# EAGLE board HackerboatControlBoard (EAGLE 6.6.0), part 1 of 2
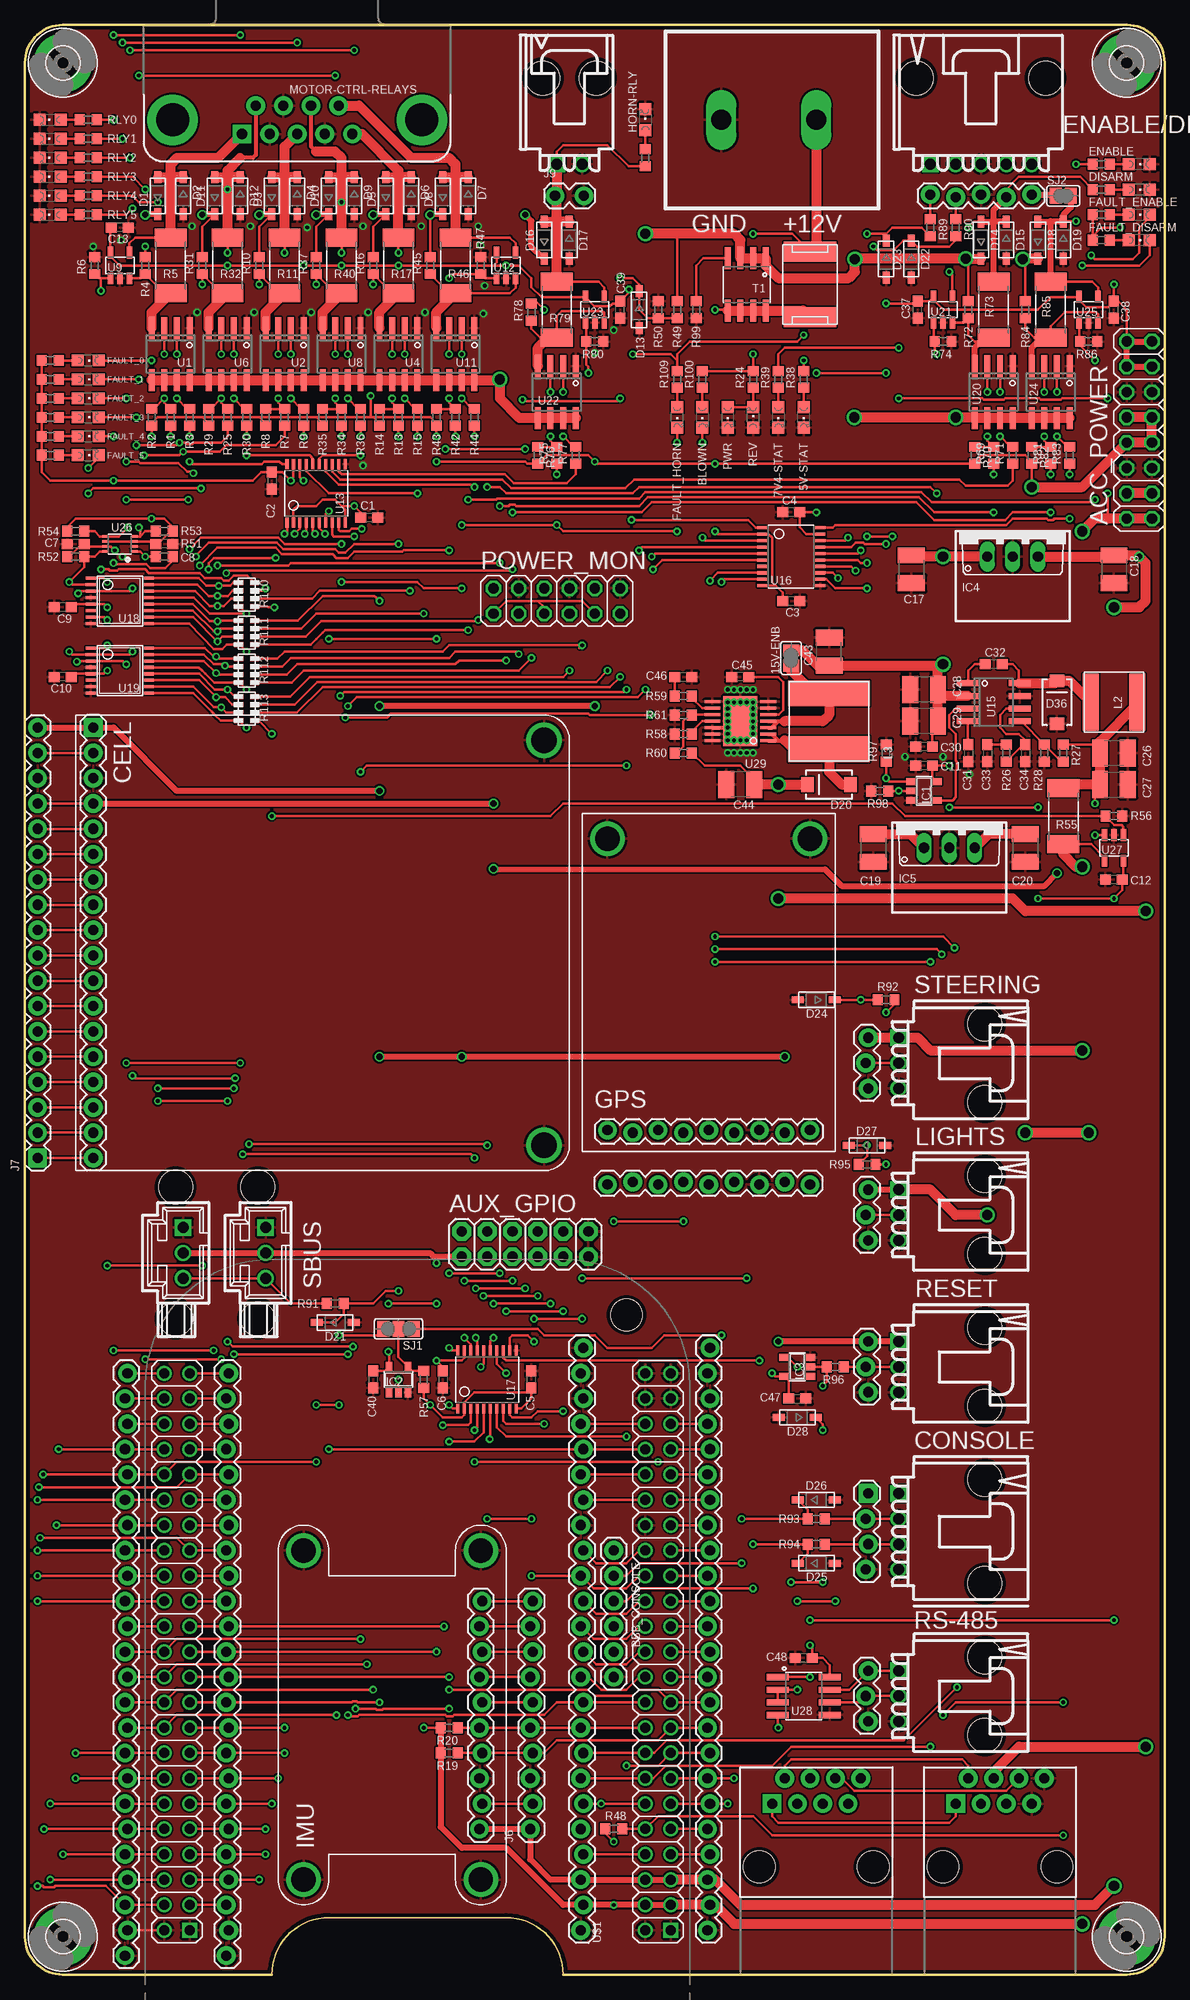
[diagram p9: board, top side]
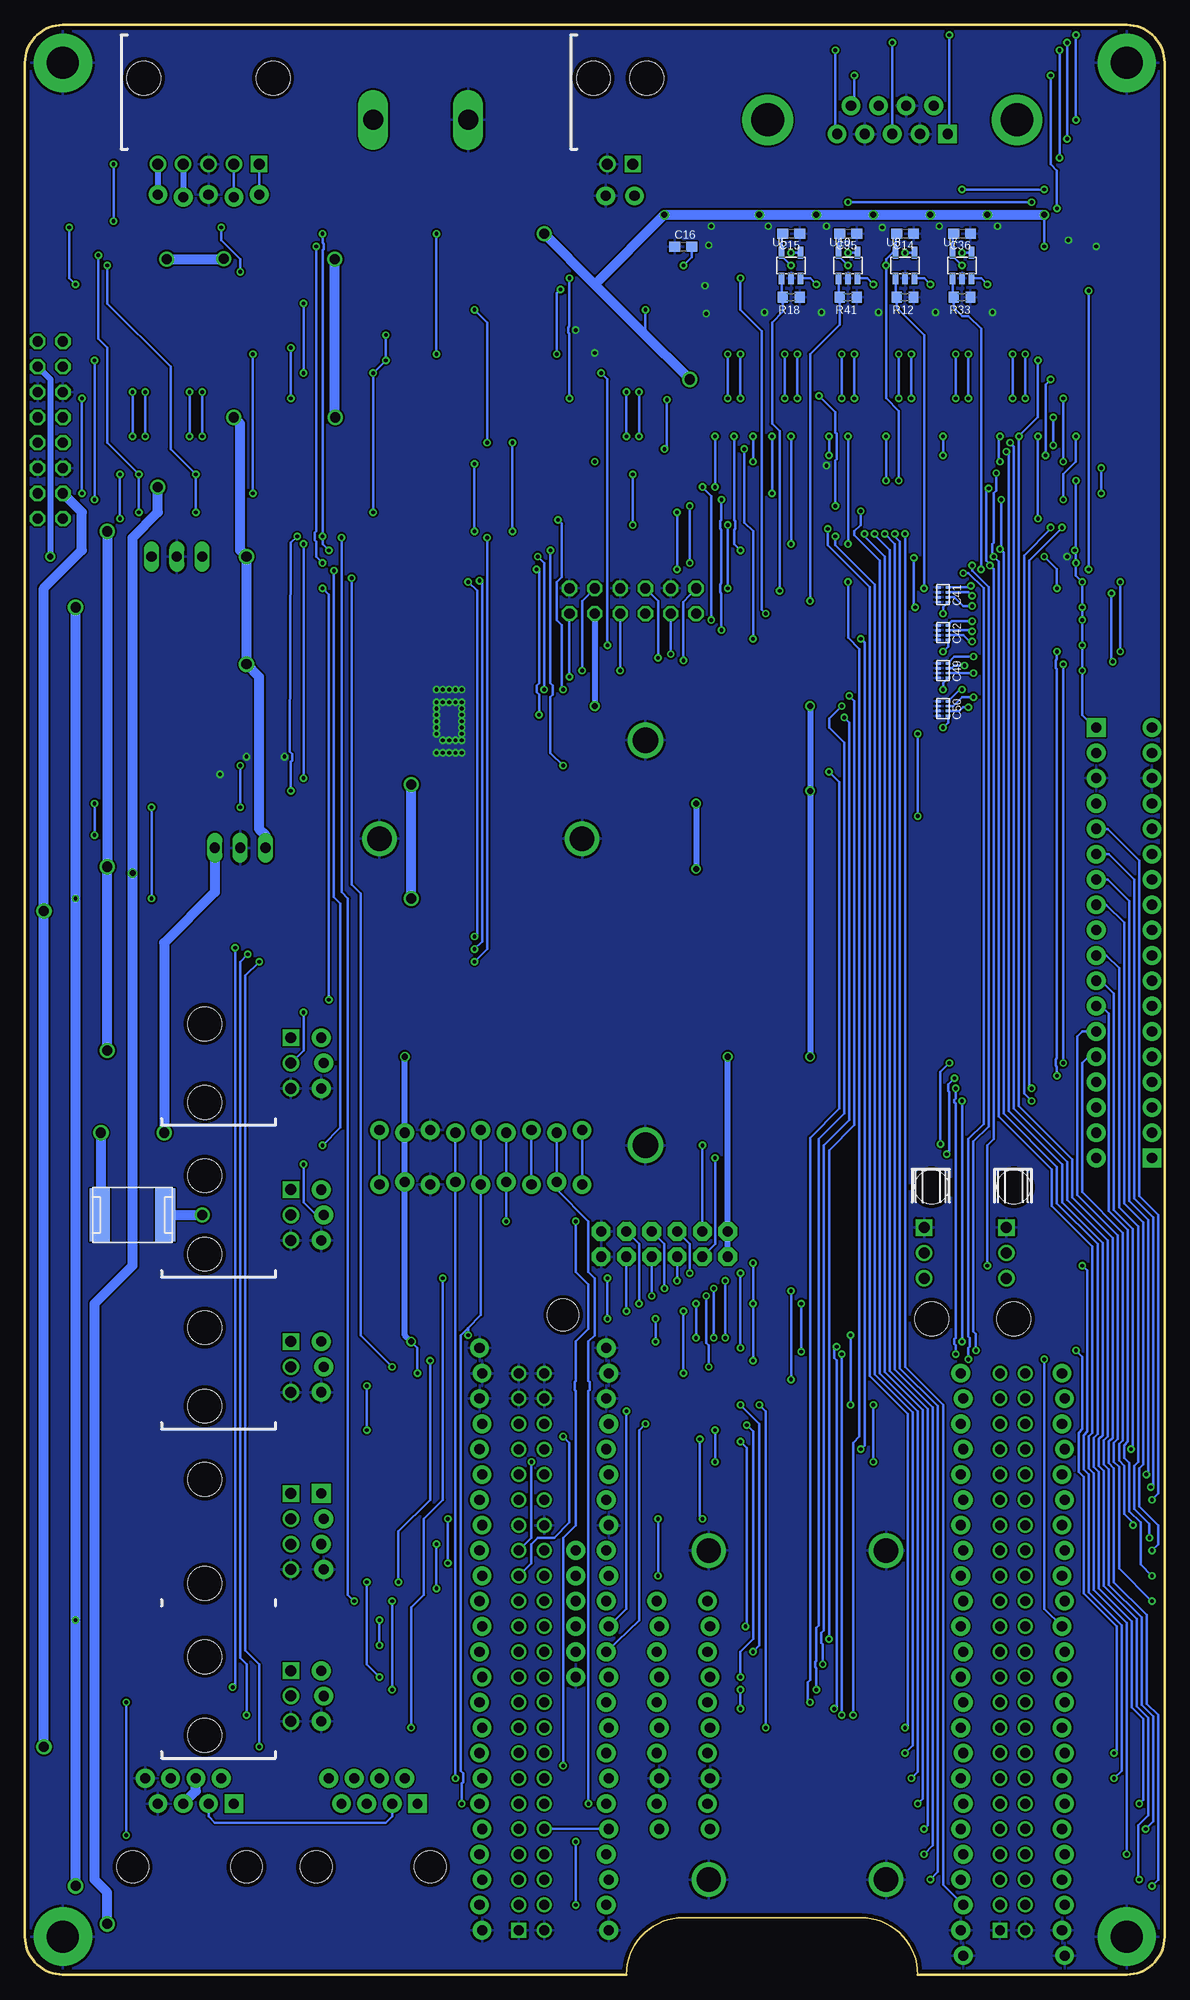
[diagram p10: board, bottom side, seen from below]

Size 114.3 x 195.58 mm. Coordinates in mm from the lower left corner, seen from the top.
Outline: 24.77,0 3.81,0 arc-90 0,3.81 0,191.77 arc-90 3.81,195.58 110.49,195.58 arc-90 114.3,191.77 114.3,3.81 arc-90 110.49,0 53.98,0
Copper layers (1*16): Top 0.0356mm / dielectric 1.5011mm / Bottom 0.0356mm
Design rules "GoldPhoenixCheap": minimum track width 7mil, minimum drill 15mil, track to track 7mil, track to pad 7mil, pad to pad 7mil, via to via 7mil, smd to smd 6mil, copper to edge 15mil, drill to drill 6mil, minimum pad ring 7mil, minimum via ring 7mil, stop-mask expansion 4mil, vias tented up to drill 15mil, thermal gap 10mil
Holes 3.17 mm at 60.32,66.17

## Footprints (pad centres in the part's own frame; a part is rotated, then mirrored left to right if it is on the bottom)
CHIPLED_0805 = smd 1.2 x 1.2: A 0,-1.05; C 0,1.05
SJ = smd 1.168 x 1.6: 1 -0.762,0; 2 0.762,0
2X08 = drill 1.016 octagon: 1 -8.89,-1.27; 2 -8.89,1.27; 3 -6.35,-1.27; 4 -6.35,1.27; 5 -3.81,-1.27; 6 -3.81,1.27; 7 -1.27,-1.27; 8 -1.27,1.27; 9 1.27,-1.27; 10 1.27,1.27; 11 3.81,-1.27; 12 3.81,1.27; 13 6.35,-1.27; 14 6.35,1.27; 15 8.89,-1.27; 16 8.89,1.27
2X6 = drill 1.016 pad 1.88 octagon: 1 0,0; 2 0,2.54; 3 2.54,0; 4 2.54,2.54; 5 5.08,0; 6 5.08,2.54; 7 7.62,0; 8 7.62,2.54; 9 10.16,0; 10 10.16,2.54; 11 12.7,0; 12 12.7,2.54
FTDI_BASIC = drill 1.016 pad 1.88: CTS 10.16,0; DTR 0,0; GND 12.7,0; RXI 2.54,0; TXO 5.08,0; VCC 7.62,0
70555-POS3 = drill 1.1 square: P$1 -2.54,0 | drill 1.1: P$2 0,0; P$3 2.54,0 | hole 3.404: -3.937,8.636; 3.937,8.636
C0603 = smd 1.1 x 1: 1 -0.85,0; 2 0.85,0
C1210 = smd 1.6 x 2.7: 1 -1.4,0; 2 1.4,0
0805X4-CAP = smd 0.5 x 0.25: 1 -0.5,0.75; 2 0.5,0.75; 3 -0.5,0.25; 4 0.5,0.25; 5 -0.5,-0.25; 6 0.5,-0.25; 7 -0.5,-0.75; 8 0.5,-0.75
FONA-3G = drill 1.016 pad 1.88 square: 5V 1.27,1.778 | drill 1.016 pad 1.88: BAT 3.81,1.778; CTS 24.13,1.778; DTR 21.59,1.778; GND 6.35,1.778; KEY 26.67,1.778; MIC+ 36.83,1.778; MIC- 39.37,1.778; NS 34.29,1.778; PS 31.75,1.778; RI 29.21,1.778; RST 11.43,1.778; RTS 19.05,1.778; RX 13.97,1.778; SPKR+ 41.91,1.778; SPKR- 44.45,1.778; TX 16.51,1.778; VIO 8.89,1.778 | drill 2.54: P$1 2.54,46.99; P$2 43.18,46.99
SOD-123 = smd 1.2 x 0.7: A 1.85,0; C -1.85,0
SPARKFUN_SMA-DIODE = smd 1.27 x 1.47: A -2.15,0; C 2.15,0
1X05_LOCK = drill 1.016 pad 1.88: 1 0,0.127; 2 2.54,-0.127; 3 5.08,0.127; 4 7.62,-0.127; 5 10.16,0.127
2920L = smd 2 x 5.3: P$1 -3.3,0; P$2 3.3,0
ULTIMATE-GPS = drill 1.016 pad 1.88: 3V3 2.54,2.159; EN 5.08,1.905; FIX 10.16,1.905; GND 17.78,2.159; PPS 22.86,2.159; RX 15.24,1.905; TX 12.7,2.159; VBAT 7.62,2.159; VIN 20.32,1.905 | drill 2.438: MNT@0 2.54,31.394; MNT@1 22.86,31.394
3,2-PAD = drill 3.2 pad 5.842: B3,2 0,0
70555-POS2 = drill 1.1 square: P$1 -1.27,0 | drill 1.1: P$2 1.27,0 | hole 3.404: -2.667,8.636; 2.667,8.636
SOT23-5 = smd 0.69 x 0.99: 1 -0.95,-1.29; 2 0,-1.29; 3 0.95,-1.29; 4 0.95,1.3; 5 -0.95,1.3
TO220V = drill 1.016 long: 1 -2.54,-2.54; 2 0,-2.54; 3 2.54,-2.54
9-DOF-BREAKOUT = drill 1.016 pad 1.88: 3VO -8.89,2.413; GINT 1.27,2.413; GND -6.35,2.667; GRDY 3.81,2.667; LIN1 6.35,2.413; LIN2 8.89,2.667; LRDY 11.43,2.413; SCL -3.81,2.413; SDA -1.27,2.667; VIN -11.43,2.667 | drill 2.438: MNT@0 -16.51,2.54; MNT@1 -16.51,20.32; MNT@2 16.51,20.32; MNT@3 16.51,2.54
1X03_LOCK = drill 1.016 pad 1.88: 1 0,0.127; 2 2.54,-0.127; 3 5.08,0.127
1X04_LOCK = drill 1.016 pad 1.88 square: 1 0,0.127 | drill 1.016 pad 1.88: 2 2.54,-0.127; 3 5.08,0.127; 4 7.62,-0.127
1X09_LOCK = drill 1.016 pad 1.88: 1 0,0.127; 2 2.54,-0.127; 3 5.08,0.127; 4 7.62,-0.127; 5 10.16,0.127; 6 12.7,-0.127; 7 15.24,0.127; 8 17.78,-0.127; 9 20.32,0.127
1X10_LOCK = drill 1.016 pad 1.88: 1 0,0.127; 2 2.54,-0.127; 3 5.08,0.127; 4 7.62,-0.127; 5 10.16,0.127; 6 12.7,-0.127; 7 15.24,0.127; 8 17.78,-0.127; 9 20.32,0.127; 10 22.86,-0.127
1X18 = drill 1.016 pad 1.88 square: 1 0,0 | drill 1.016 pad 1.88: 2 2.54,0; 3 5.08,0; 4 7.62,0; 5 10.16,0; 6 12.7,0; 7 15.24,0; 8 17.78,0; 9 20.32,0; 10 22.86,0; 11 25.4,0; 12 27.94,0; 13 30.48,0; 14 33.02,0; 15 35.56,0; 16 38.1,0; 17 40.64,0; 18 43.18,0
1X02_LOCK = drill 1.016 pad 1.88: 1 -0.178,0; 2 2.718,0
NR60XX = smd 5.7 x 1.6: 1 0,2.35; 2 0,-2.35
SRN8040 = smd 2.6 x 8.2: 1 -2.8,0; 2 2.8,0
DB9 = drill 1.016 pad 1.88 square: 1 -5.54,-1.42 | drill 1.016 pad 1.88: 2 -2.77,-1.42; 3 0,-1.42; 4 2.77,-1.42; 5 5.54,-1.42; 6 -4.15,1.42; 7 -1.38,1.42; 8 1.38,1.42; 9 4.15,1.42 | drill 3.302 pad 5.08: G1 -12.5,0; G2 12.5,0
RJ45-8 = drill 1 pad 1.88 square: 1 -4.445,6.35 | drill 1 pad 1.88: 2 -3.175,8.89; 3 -1.905,6.35; 4 -0.635,8.89; 5 0.635,6.35; 6 1.905,8.89; 7 3.175,6.35; 8 4.445,8.89 | hole 3.2: -5.715,0; 5.715,0
CONN-2 = drill 2 long: 1 -5.08,0; 2 4.445,0
2X06 = drill 1.016 octagon: 1 -6.35,-1.27; 2 -6.35,1.27; 3 -3.81,-1.27; 4 -3.81,1.27; 5 -1.27,-1.27; 6 -1.27,1.27; 7 1.27,-1.27; 8 1.27,1.27; 9 3.81,-1.27; 10 3.81,1.27; 11 6.35,-1.27; 12 6.35,1.27
70555-POS5 = drill 1.1 square: P$1 -5.08,0 | drill 1.1: P$2 -2.54,0; P$3 0,0; P$4 2.54,0; P$5 5.08,0 | hole 3.404: -6.477,8.636; 6.477,8.636
R0603 = smd 1 x 1.1: 1 -0.85,0; 2 0.85,0
R2512 = smd 1.8 x 3.2: 1 -2.8,0; 2 2.8,0
CTS742C083-RES = smd 0.9 x 0.5: 1 -0.8,1.2; 2 0.8,1.2; 3 -0.8,0.4; 4 0.8,0.4; 5 -0.8,-0.4; 6 0.8,-0.4; 7 -0.8,-1.2; 8 0.8,-1.2
70545-POS3 = drill 1.1 square: P$1 2.54,0 | drill 1.1: P$2 0,0; P$3 -2.54,0 | hole 3.404: -6.604,0.762; 6.604,0.762
70555-POS4 = drill 1.1 square: P$1 -3.81,0 | drill 1.1: P$2 -1.27,0; P$3 1.27,0; P$4 3.81,0 | hole 3.404: -5.207,8.636; 5.207,8.636
SJ_2 = smd 1.168 x 1.6: 1 -1.524,0; 2 0,0; 3 1.524,0
SO08 = smd 0.61 x 2.21: 1 -1.905,-2.616; 2 -0.635,-2.616; 3 0.635,-2.616; 4 1.905,-2.616; 5 1.905,2.616; 6 0.635,2.616; 7 -0.635,2.616; 8 -1.905,2.616
SO08' = smd 0.6 x 2.2: 1 -1.905,-2.6; 2 -0.635,-2.6; 3 0.635,-2.6; 4 1.905,-2.6; 5 1.905,2.6; 6 0.635,2.6; 7 -0.635,2.6; 8 -1.905,2.6
SOT23-5L = smd 0.55 x 1.2: 1 -0.95,-1.3; 2 0,-1.3; 3 0.95,-1.3; 4 0.95,1.3; 5 -0.95,1.3
TSSOP20 = smd 0.305 x 0.991: 1 -2.925,-2.918; 2 -2.275,-2.918; 3 -1.625,-2.918; 4 -0.975,-2.918; 5 -0.325,-2.918; 6 0.325,-2.918; 7 0.975,-2.918; 8 1.625,-2.918; 9 2.275,-2.918; 10 2.925,-2.918; 11 2.925,2.918; 12 2.275,2.918; 13 1.625,2.918; 14 0.975,2.918; 15 0.325,2.918; 16 -0.325,2.918; 17 -0.975,2.918; 18 -1.625,2.918; 19 -2.275,2.918; 20 -2.925,2.918
TSSOP16 = smd 0.305 x 0.991: 1 -2.275,-2.918; 2 -1.625,-2.918; 3 -0.975,-2.918; 4 -0.325,-2.918; 5 0.325,-2.918; 6 0.975,-2.918; 7 1.625,-2.918; 8 2.275,-2.918; 9 2.275,2.918; 10 1.625,2.918; 11 0.975,2.918; 12 0.325,2.918; 13 -0.325,2.918; 14 -0.975,2.918; 15 -1.625,2.918; 16 -2.275,2.918
VFSOP-8 = smd 0.25 x 0.65: P$1 -0.75,-1.45; P$2 -0.25,-1.45; P$3 0.25,-1.45; P$4 0.75,-1.45; P$5 0.75,1.45; P$6 0.25,1.45; P$7 -0.25,1.45; P$8 -0.75,1.45
HTSSOP14 = smd 0.3 x 1.6: 1 -1.95,-2.8; 2 -1.3,-2.8; 3 -0.65,-2.8; 4 0,-2.8; 5 0.65,-2.8; 6 1.3,-2.8; 7 1.95,-2.8; 8 1.3,2.8; 9 0.65,2.8; 10 0,2.8; 11 -0.65,2.8; 12 -1.3,2.8; 13 -1.95,2.8; 14 1.95,2.8 | smd 5 x 3.4: P$1 0,0
BEAGLEBONE_SHIELD = drill 1 square: 1 4.445,19.05; 47 52.705,19.05 | drill 1: 2 1.905,19.05; 3 4.445,21.59; 4 1.905,21.59; 5 4.445,24.13; 6 1.905,24.13; 7 4.445,26.67; 8 1.905,26.67; 9 4.445,29.21; 10 1.905,29.21; 11 4.445,31.75; 12 1.905,31.75; 13 4.445,34.29; 14 1.905,34.29; 15 4.445,36.83; 16 1.905,36.83; 17 4.445,39.37; 18 1.905,39.37; 19 4.445,41.91; 20 1.905,41.91; 21 4.445,44.45; 22 1.905,44.45; 23 4.445,46.99; 24 1.905,46.99; 25 4.445,49.53; 26 1.905,49.53; 27 4.445,52.07; 28 1.905,52.07; 29 4.445,54.61; 30 1.905,54.61; 31 4.445,57.15; 32 1.905,57.15; 33 4.445,59.69; 34 1.905,59.69; 35 4.445,62.23; 36 1.905,62.23; 37 4.445,64.77; 38 1.905,64.77; 39 4.445,67.31; 40 1.905,67.31; 41 4.445,69.85; 42 1.905,69.85; 43 4.445,72.39; 44 1.905,72.39; 45 4.445,74.93; 46 1.905,74.93; 48 50.165,19.05; 49 52.705,21.59; 50 50.165,21.59; 51 52.705,24.13; 52 50.165,24.13; 53 52.705,26.67; 54 50.165,26.67; 55 52.705,29.21; 56 50.165,29.21; 57 52.705,31.75; 58 50.165,31.75; 59 52.705,34.29; 60 50.165,34.29; 61 52.705,36.83; 62 50.165,36.83; 63 52.705,39.37; 64 50.165,39.37; 65 52.705,41.91; 66 50.165,41.91; 67 52.705,44.45; 68 50.165,44.45; 69 52.705,46.99; 70 50.165,46.99; 71 52.705,49.53; 72 50.165,49.53; 73 52.705,52.07; 74 50.165,52.07; 75 52.705,54.61; 76 50.165,54.61; 77 52.705,57.15; 78 50.165,57.15; 79 52.705,59.69; 80 50.165,59.69; 81 52.705,62.23; 82 50.165,62.23; 83 52.705,64.77; 84 50.165,64.77; 85 52.705,67.31; 86 50.165,67.31; 87 52.705,69.85; 88 50.165,69.85; 89 52.705,72.39; 90 50.165,72.39; 91 52.705,74.93; 92 50.165,74.93
1X24_LOCK = drill 1.016 pad 1.88: 2 -26.67,0.127; 3 -24.13,-0.127; 4 -21.59,0.127; 5 -19.05,-0.127; 6 -16.51,0.127; 7 -13.97,-0.127; 8 -11.43,0.127; 9 -8.89,-0.127; 10 -6.35,0.127; 11 -3.81,-0.127; 12 -1.27,0.127; 13 1.27,-0.127; 14 3.81,0.127; 15 6.35,-0.127; 16 8.89,0.127; 17 11.43,-0.127; 18 13.97,0.127; 19 16.51,-0.127; 20 19.05,0.127; 21 21.59,-0.127; 22 24.13,0.127; 23 26.67,-0.127; 24 29.21,0.127; 25 31.75,-0.127

## Placement (x,y rotation side)
5V-STAT  GRN  [CHIPLED_0805]  78.11,156.21 180 top
7V4-STAT  GRN  [CHIPLED_0805]  75.56,156.21 180 top
15V-ENB  [SJ]  76.83,132.08 270 top
ACC_POWER  [2X08]  111.76,154.94 270 top
AUX_GPIO  2X6 FEMALE  [2X6]  43.81,72.01 0 top
BBB_CONSOLE  FTDI_BASICPTH  [FTDI_BASIC]  59.05,42.55 270 top
BBB_RESET  HEADER_POS3_70555  [70555-POS3]  87.63,60.96 270 top
BLOWN  RED  [CHIPLED_0805]  67.94,156.21 180 top
C1  100n  [C0603]  34.54,146.18 0 top
C2  100n  [C0603]  24.77,149.86 270 top
C3  100n  [C0603]  76.83,137.79 0 top
C4  100n  [C0603]  76.83,146.69 180 top
C5  100n  [C0603]  50.8,59.69 90 top
C6  100n  [C0603]  41.91,59.69 270 top
C7  100n  [C0603]  5.08,143.51 180 top
C8  100n  [C0603]  13.97,143.51 180 top
C9  100n  [C0603]  3.81,137.16 180 top
C10  100n  [C0603]  3.81,130.18 180 top
C11  100n  [C0603]  90.17,121.28 180 top
C12  100n  [C0603]  109.22,109.86 180 top
C13  100n  [C0603]  9.53,175.26 180 top
C14  100n  [C0603]  26.04,174.62 180 bottom
C15  100n  [C0603]  37.47,174.62 180 bottom
C16  100n  [C0603]  48.26,173.35 0 bottom
C17  10u  [C1210]  88.9,140.97 270 top
C18  22u  [C1210]  109.22,140.97 270 top
C19  10u  [C1210]  85.09,113.03 270 top
C20  22u  [C1210]  100.33,113.03 270 top
C26  4u7  [C1210]  109.22,122.56 0 top
C27  4u7  [C1210]  109.22,119.38 0 top
C28  10u  [C1210]  90.17,128.91 180 top
C29  10u  [C1210]  90.17,125.73 180 top
C30  10n  [C0603]  90.17,123.19 180 top
C31  8n2  [C0603]  94.61,122.56 270 top
C32  100n  [C0603]  97.16,131.44 180 top
C33  7p5  [C0603]  96.52,122.56 270 top
C34  220p  [C0603]  100.33,122.56 270 top
C35  100n  [C0603]  31.75,174.62 180 bottom
C36  100n  [C0603]  20.32,174.62 180 bottom
C37  100n  [C0603]  89.53,167 90 top
C38  100n  [C0603]  109.22,167 90 top
C39  100n  [C0603]  59.69,167 90 top
C40  100n  [C0603]  34.92,59.69 270 top
C41  22n  [0805X4-CAP]  22.23,138.43 180 bottom
C42  22n  [0805X4-CAP]  22.23,134.62 180 bottom
C43  4u7  [C1210]  80.64,132.72 90 top
C44  4u7  [C1210]  71.75,119.38 180 top
C45  47n  [C0603]  71.75,130.18 180 top
C46  68n  [C0603]  66.04,130.18 0 top
C47  100n  [C0603]  77.47,57.78 0 top
C48  100n  [C0603]  78.11,31.75 180 top
C49  22n  [0805X4-CAP]  22.23,130.81 180 bottom
C50  22n  [0805X4-CAP]  22.23,127 180 bottom
CELL  FONA  [FONA-3G]  5.08,126.36 270 top
D1  [SOD-123]  13.34,178.44 90 top
D2  [SOD-123]  15.88,178.44 270 top
D3  [SOD-123]  24.77,178.44 90 top
D4  [SOD-123]  27.3,178.44 270 top
D5  [SOD-123]  36.2,178.44 90 top
D6  [SOD-123]  38.73,178.44 270 top
D7  [SOD-123]  44.45,178.44 270 top
D8  [SOD-123]  41.91,178.44 90 top
D9  [SOD-123]  33.02,178.44 270 top
D10  [SOD-123]  30.48,178.44 90 top
D11  [SOD-123]  19.05,178.44 90 top
D12  [SOD-123]  21.59,178.44 270 top
D13  1V8  [SOD-123]  61.59,167 270 top
D14  [SOD-123]  95.89,173.99 90 top
D15  [SOD-123]  98.42,173.99 270 top
D16  [SOD-123]  52.07,173.99 90 top
D17  [SOD-123]  54.61,173.99 270 top
D18  [SOD-123]  101.6,173.99 90 top
D19  [SOD-123]  104.14,173.99 270 top
D20  [SPARKFUN_SMA-DIODE]  80.64,119.38 180 top
D21  5V  [SOD-123]  31.11,65.41 0 top
D22  5V  [SOD-123]  88.9,172.09 270 top
D23  5V  [SOD-123]  86.36,172.09 270 top
D24  5V  [SOD-123]  79.38,97.79 180 top
D25  5V  [SOD-123]  79.38,41.27 0 top
D26  5V  [SOD-123]  79.38,47.62 0 top
D27  5V  [SOD-123]  84.45,83.19 0 top
D28  5V  [SOD-123]  77.47,55.88 180 top
D36  [SPARKFUN_SMA-DIODE]  103.5,127.64 90 top
DISARM  AMB  [CHIPLED_0805]  111.76,179.07 270 top
ENABLE  GRN  [CHIPLED_0805]  111.76,181.61 270 top
ENABLE/DISARM  [1X05_LOCK]  90.81,178.44 0 top
F1  PTC-2920  [2920L]  78.74,169.54 270 top
F2  PTC-2920  [2920L]  103.5,76.2 180 bottom
FAULT_0  RED  [CHIPLED_0805]  6.35,161.93 270 top
FAULT_1  RED  [CHIPLED_0805]  6.35,160.02 270 top
FAULT_2  RED  [CHIPLED_0805]  6.35,158.12 270 top
FAULT_3  RED  [CHIPLED_0805]  6.35,156.21 270 top
FAULT_4  RED  [CHIPLED_0805]  6.35,154.31 270 top
FAULT_5  RED  [CHIPLED_0805]  6.35,152.4 270 top
FAULT_DISARM  RED  [CHIPLED_0805]  111.76,173.99 270 top
FAULT_ENABLE  RED  [CHIPLED_0805]  111.76,176.53 270 top
FAULT_HORN  RED  [CHIPLED_0805]  65.41,156.21 180 top
GPS  ULTIMATE-GPS  [ULTIMATE-GPS]  55.88,82.55 0 top
H1  MOUNT-PAD-ROUND3.2  [3,2-PAD]  110.49,191.77 0 top
H3  MOUNT-PAD-ROUND3.2  [3,2-PAD]  110.49,3.81 0 top
H4  MOUNT-PAD-ROUND3.2  [3,2-PAD]  3.81,191.77 0 top
H7  MOUNT-PAD-ROUND3.2  [3,2-PAD]  3.81,3.81 0 top
HORN  HEADER_POS2_70555  [70555-POS2]  54.61,181.61 0 top
HORN-RLY  RED  [CHIPLED_0805]  62.23,186.06 0 top
IC1  74AHC1G08DBV  [SOT23-5]  90.17,118.75 270 top
IC2  74AUC1G06DBV  [SOT23-5]  37.47,59.69 0 top
IC3  74AHC1G04DBV  [SOT23-5]  77.47,60.96 90 top
IC4  V7805-2000  [TO220V]  99.06,144.78 0 top
IC5  V7805-2000  [TO220V]  92.71,115.57 0 top
IMU  9-DOF-BREAKOUT  [9-DOF-BREAKOUT]  48.26,26.04 90 top
J1  [1X03_LOCK]  84.45,93.98 270 top
J2  [1X03_LOCK]  84.45,78.74 270 top
J3  [1X04_LOCK]  84.45,48.26 270 top
J5  [1X09_LOCK]  78.74,79.38 180 top
J6  [1X10_LOCK]  50.8,14.61 90 top
J7  [1X18]  1.27,81.92 90 top
J9  [1X02_LOCK]  53.34,178.44 0 top
J10  [1X03_LOCK]  84.45,63.5 270 top
J11  [1X03_LOCK]  84.45,30.48 270 top
L2  22u  [NR60XX]  109.22,127.64 90 top
L3  22u  [SRN8040]  80.64,125.73 270 top
MOTOR-CTRL-RELAYS  [DB9]  27.3,186.06 0 top
POE-DEVICE  RJ45  [RJ45-8]  97.79,10.79 0 top
POE-LAN  RJ45  [RJ45-8]  79.38,10.79 0 top
POWER_INPUT  3-1437664-0  [CONN-2]  74.93,186.06 0 top
POWER_MON  [2X06]  53.34,137.79 0 top
POWER_STATE  HEADER_POS5_70555  [70555-POS5]  95.89,181.61 0 top
PWR  GRN  [CHIPLED_0805]  70.48,156.21 180 top
R1  10K  [R0603]  14.61,156.21 90 top
R2  10K  [R0603]  12.7,156.21 270 top
R3  10K  [R0603]  16.51,156.21 90 top
R4  100K  [R0603]  12.06,171.45 90 top
R5  0R05  [R2512]  14.61,171.45 90 top
R6  33K  [R0603]  6.99,171.45 270 top
R7  10K  [R0603]  26.04,156.21 90 top
R8  10K  [R0603]  24.13,156.21 270 top
R9  10K  [R0603]  27.94,156.21 90 top
R10  100K  [R0603]  23.5,171.45 90 top
R11  0R05  [R2512]  26.04,171.45 90 top
R12  33K  [R0603]  26.04,168.28 180 bottom
R13  10K  [R0603]  37.47,156.21 90 top
R14  10K  [R0603]  35.56,156.21 270 top
R15  10K  [R0603]  39.37,156.21 90 top
R16  100K  [R0603]  34.92,171.45 90 top
R17  0R05  [R2512]  37.47,171.45 90 top
R18  33K  [R0603]  37.47,168.28 180 bottom
R19  4K7'  [R0603]  42.55,22.23 180 top
R20  4K7  [R0603]  42.55,24.77 180 top
R24  1K  [R0603]  73.03,160.02 90 top
R25  10K  [R0603]  20.32,156.21 90 top
R26  11K5  [R0603]  98.42,122.56 270 top
R27  10K2  [R0603]  104.14,122.56 90 top
R28  1K24  [R0603]  102.23,122.56 90 top
R29  10K  [R0603]  18.41,156.21 270 top
R30  10K  [R0603]  22.23,156.21 90 top
R31  100K  [R0603]  17.78,171.45 90 top
R32  0R05  [R2512]  20.32,171.45 90 top
R33  33K  [R0603]  20.32,168.28 180 bottom
R34  10K  [R0603]  31.75,156.21 90 top
R35  10K  [R0603]  29.84,156.21 270 top
R36  10K  [R0603]  33.66,156.21 90 top
R37  100K  [R0603]  29.21,171.45 90 top
R38  1K  [R0603]  78.11,160.02 90 top
R39  1K  [R0603]  75.56,160.02 90 top
R40  0R05  [R2512]  31.75,171.45 90 top
R41  33K  [R0603]  31.75,168.28 180 bottom
R42  10K  [R0603]  43.18,156.21 90 top
R43  10K  [R0603]  41.27,156.21 270 top
R44  10K  [R0603]  45.09,156.21 90 top
R45  100K  [R0603]  40.64,171.45 90 top
R46  0R05  [R2512]  43.18,171.45 90 top
R47  33K  [R0603]  45.72,171.45 270 top
R48  10K  [R0603]  59.05,14.61 0 top
R49  110K  [R0603]  65.41,167 90 top
R50  15K  [R0603]  63.5,167 270 top
R51  4K7  [R0603]  13.97,142.24 0 top
R52  4K7  [R0603]  5.08,142.24 180 top
R53  4K7  [R0603]  13.97,144.78 0 top
R54  4K7  [R0603]  5.08,144.78 180 top
R55  0R05  [R2512]  104.14,116.2 270 top
R56  33K  [R0603]  109.22,116.2 180 top
R57  10K  [R0603]  40.01,59.69 270 top
R58  174K  [R0603]  66.04,124.46 0 top
R59  1K62  [R0603]  66.04,128.27 0 top
R60  182K  [R0603]  66.04,122.56 0 top
R61  16K2  [R0603]  66.04,126.36 0 top
R62  1K  [R0603]  6.35,186.06 0 top
R63  1K  [R0603]  6.35,184.15 0 top
R64  1K  [R0603]  6.35,182.25 0 top
R65  1K  [R0603]  6.35,180.34 0 top
R66  1K  [R0603]  6.35,178.44 0 top
R67  1K  [R0603]  6.35,176.53 0 top
R68  1K  [R0603]  107.95,179.07 180 top
R69  10K  [R0603]  97.16,152.4 90 top
R70  10K  [R0603]  95.25,152.4 270 top
R71  10K  [R0603]  99.06,152.4 90 top
R72  100K  [R0603]  94.61,167 90 top
R73  0R05  [R2512]  97.16,167 90 top
R74  33K  [R0603]  92.08,163.83 180 top
R75  10K  [R0603]  53.34,152.4 90 top
R76  10K  [R0603]  51.44,152.4 270 top
R77  10K  [R0603]  55.24,152.4 90 top
R78  100K  [R0603]  50.8,166.75 90 top
R79  0R05  [R2512]  53.34,167 90 top
R80  33K  [R0603]  57.15,163.83 180 top
R81  10K  [R0603]  102.87,152.4 90 top
R82  10K  [R0603]  100.97,152.4 270 top
R83  10K  [R0603]  104.78,152.4 90 top
R84  100K  [R0603]  100.33,167 90 top
R85  0R05  [R2512]  102.87,167 90 top
R86  33K  [R0603]  106.68,163.83 180 top
R87  1K  [R0603]  107.95,181.61 180 top
R88  1K  [R0603]  62.23,182.25 270 top
R89  1K  [R0603]  90.81,175.26 270 top
R90  1K  [R0603]  93.34,175.26 270 top
R91  1K  [R0603]  31.11,67.31 0 top
R92  1K  [R0603]  86.36,97.79 180 top
R93  1K  [R0603]  79.38,45.72 180 top
R94  1K  [R0603]  79.38,43.18 180 top
R95  1K  [R0603]  84.45,81.28 180 top
R96  1K  [R0603]  81.28,60.96 180 top
R97  10K  [R0603]  86.36,122.56 90 top
R98  10K  [R0603]  85.72,118.75 180 top
R99  10K  [R0603]  67.31,167 90 top
R100  1K  [R0603]  67.94,160.02 270 top
R101  1K  [R0603]  2.54,161.93 180 top
R102  1K  [R0603]  2.54,160.02 180 top
R103  1K  [R0603]  2.54,158.12 180 top
R104  1K  [R0603]  2.54,156.21 180 top
R105  1K  [R0603]  2.54,154.31 180 top
R106  1K  [R0603]  2.54,152.4 180 top
R107  1K  [R0603]  107.95,176.53 180 top
R108  1K  [R0603]  107.95,173.99 180 top
R109  1K  [R0603]  65.41,160.02 90 top
R110  10K  [CTS742C083-RES]  22.23,138.43 0 top
R111  10K  [CTS742C083-RES]  22.23,134.62 0 top
R112  10K  [CTS742C083-RES]  22.23,130.81 0 top
R113  10K  [CTS742C083-RES]  22.23,127 0 top
REV  RED  [CHIPLED_0805]  73.03,156.21 0 top
RLY0  GRN  [CHIPLED_0805]  2.54,186.06 90 top
RLY1  GRN  [CHIPLED_0805]  2.54,184.15 90 top
RLY2  GRN  [CHIPLED_0805]  2.54,182.25 90 top
RLY3  GRN  [CHIPLED_0805]  2.54,180.34 90 top
RLY4  GRN  [CHIPLED_0805]  2.54,178.44 90 top
RLY5  GRN  [CHIPLED_0805]  2.54,176.53 90 top
RS485  HEADER_POS3_70555  [70555-POS3]  87.63,27.94 270 top
SBUS-IN  HEADER_POS3_70545  [70545-POS3]  15.88,72.39 90 top
SBUS-OUT  HEADER_POS3_70545  [70545-POS3]  24.13,72.39 90 top
SERIAL_CONSOLE  HEADER_POS4_70555  [70555-POS4]  87.63,44.45 270 top
SJ1  [SJ_2]  37.47,64.77 180 top
SJ2  [SJ]  104.14,178.44 0 top
STATUS_LIGHTS  HEADER_POS3_70555  [70555-POS3]  87.63,76.2 270 top
STEERING  HEADER_POS3_70555  [70555-POS3]  87.63,91.44 270 top
T1  AO4407A  [SO08]  72.39,169.54 180 top
U1  IPS6041G  [SO08']  14.61,162.56 180 top
U2  IPS6041G  [SO08']  26.04,162.56 180 top
U3  INA169  [SOT23-5L]  26.04,171.45 0 bottom
U4  IPS6041G  [SO08']  37.47,162.56 180 top
U5  INA169  [SOT23-5L]  37.47,171.45 0 bottom
U6  IPS6041G  [SO08']  20.32,162.56 180 top
U7  INA169  [SOT23-5L]  20.32,171.45 0 bottom
U8  IPS6041G  [SO08']  31.75,162.56 180 top
U9  INA169  [SOT23-5L]  9.53,171.45 0 top
U10  INA169  [SOT23-5L]  31.75,171.45 0 bottom
U11  IPS6041G  [SO08']  43.18,162.56 180 top
U12  INA169  [SOT23-5L]  48.26,171.45 0 top
U13  [TSSOP20]  29.21,148.59 0 top
U15  TPS54331  [SO08']  97.16,127.64 270 top
U16  [TSSOP20]  76.83,142.24 270 top
U17  [TSSOP20]  46.35,59.69 0 top
U18  ADC128D818  [TSSOP16]  9.53,137.79 270 top
U19  ADC128D818  [TSSOP16]  9.53,130.81 270 top
U20  IPS6041G  [SO08']  97.16,158.75 180 top
U21  INA169  [SOT23-5L]  92.08,167 0 top
U22  IPS6041G  [SO08']  53.34,158.75 180 top
U23  INA169  [SOT23-5L]  57.15,167 0 top
U24  IPS6041G  [SO08']  102.87,158.75 180 top
U25  INA169  [SOT23-5L]  106.68,167 0 top
U26  [VFSOP-8]  9.53,143.51 90 top
U27  INA169  [SOT23-5L]  109.22,113.03 180 top
U28  RS485SOIC  [SO08]  78.11,27.94 270 top
U29  TPS61175  [HTSSOP14]  71.75,125.73 90 top
U$1  BEAGLEBONE_OUTLINE  [BEAGLEBONE_SHIELD]  12.06,-14.61 0 top
U$2  M24LOCK  [1X24_LOCK]  55.88,36.2 270 top
U$3  M24LOCK  [1X24_LOCK]  10.16,33.66 270 top
U$4  M24LOCK  [1X24_LOCK]  20.32,33.66 270 top
U$5  M24LOCK  [1X24_LOCK]  68.58,36.2 270 top

## Tracks (layer width: path | path; a pad name or v marks a point on that pad's centre or on a via)
+3V3  (via drill 0.38, 0.61, 1.02)
  Top 0.254: 17.78,156.21 13.34,156.21 12.7,155.57 R2.2 v12.7,154.31 | 17.78,156.21 23.5,156.21 | 23.5,156.21 29.21,156.21 | 29.21,156.21 34.54,156.21 | 34.54,156.21 34.92,156.21 | 34.92,156.21 40.64,156.21 41.27,155.57 R43.2 v41.27,154.31 | R14.2 35.56,155.57 34.92,156.21 | R35.2 29.84,155.57 29.21,156.21 | R8.2 24.13,155.57 23.5,156.21 | R29.2 18.41,155.57 17.78,156.21 | U13.2 26.93,146.95 27.3,147.32 29.21,147.32 29.84,147.96 31.11,147.96 31.75,147.32 | U13.10 32.13,146.94 31.75,147.32 | 31.75,147.32 v33.02,147.32 33.69,146.65 C1.1 | v34.67,158.37 34.67,156.34 34.54,156.21 | R48.1 58.2,14.19 v59.05,13.34 | R76.2 51.02,151.55 | v41.27,151.76 50.16,151.76 50.38,151.55 R76.2 | R76.2 52.28,152.4 56.52,152.4 v57.15,151.76 57.37,151.55 v69.22,151.55 R70.2 95.25,151.76 95.89,152.4 100.33,152.4 100.97,151.76 R82.2 v100.97,149.22 | J7.15 CELL.VIO | R53.2 14.61,144.78 | 14.61,144.78 13.34,143.51 C8.2 12.87,143.76 U26.P$3 U26.P$6 | 14.61,144.78 14.61,145.41 13.97,146.05 v12.7,146.05 5.08,146.05 4.23,145.2 R54.2 | U16.10 75.31,139.31 | C3.1 75.98,138.65 75.31,139.31 | 75.31,139.31 74.93,139.7 74.93,144.15 74.56,144.51 U16.2 69.48,144.51 v69.22,144.78 | U17.10 49.79,56.77 50.8,57.78 C5.1 50.38,58.42 45.09,58.42 44.08,57.41 U17.2 44.08,56.15 43.81,55.88 41.91,55.88 v40.64,57.15 40.01,57.78 R57.2 | R20.2 v40.01,24.77
  Top 0.61: R20.2 R19.2 41.7,14.82 43.81,12.7 48.26,12.7 53.98,6.99 U$2.24 v59.05,6.99 U$1.50 U$1.49 | CELL.VIO v46.99,117.47 | v46.99,110.91 80.26,110.87 81.92,109.22 102.23,109.22 v103.5,110.49
  Top 1.016: v106.05,5.08 71.12,5.08 69.22,6.99 U$5.24 U$1.49 | v100.97,149.22 106.05,149.22 ACC_POWER.9 ACC_POWER.10 ACC_POWER.8 ACC_POWER.7
  Bottom 0.254: v33.02,147.32 33.02,151.89 32.89,152.02 32.89,154.56 33.02,154.69 33.02,156.72 v34.67,158.37 | v59.05,13.34 v59.05,6.99 | v41.27,151.76 v41.27,154.31 | v12.7,146.05 v12.7,154.31 | v69.22,144.78 v69.22,151.55 | v40.01,24.77 40.01,56.52 v40.64,57.15
  Bottom 0.61: v46.99,117.47 v46.99,110.91
  Bottom 1.016: v106.05,5.08 106.05,8.26 107.31,9.53 107.31,67.31 103.5,71.12 v103.5,110.49 103.5,144.15 100.97,146.69 v100.97,149.22
+5V  (via drill 0.36, 0.38, 0.61, 1.02)
  Top 0.254: U12.5 47.31,171.77 46.99,171.45 | 46.99,171.45 v37.47,171.45 v31.75,171.45 v27.94,171.45 v20.32,171.45 9.53,171.45 8.57,172.4 U9.5 8.57,175.16 C13.2 | U13.19 26.93,150.23 v26.67,149.86 25.82,150.71 C2.1 23.71,150.71 22.86,149.86 v8.89,149.86 2.54,149.86 1.69,150.71 R106.2 R105.2 R104.2 R103.2 R102.2 R101.2 | 46.99,171.45 v48.26,171.45 49.53,171.45 50.8,170.18 50.8,169.29 51.82,168.28 56.17,168.28 U23.5 57.12,167.39 58.67,167.39 58.93,167.64 59.48,167.64 C39.2 60.58,168.74 v60.58,169.04 | U21.5 91.12,167.96 | U21.5 90.67,167.85 C37.2 89.32,167.64 v86.36,167.64 | U18.1 7.88,140.07 v8.26,139.7 | v8.26,130.81 7.93,130.49 U19.5 4.97,130.49 C10.1 | v8.26,137.16 7.95,137.47 U18.5 4.99,137.47 C9.1 | U18.7 7.97,136.17 v8.26,135.89 | U19.1 7.99,133.09 v8.26,133.35 | POWER_MON.1 48.26,137.79 51.44,137.79 | 51.44,137.79 55.88,137.79 POWER_MON.9 | POWER_MON.5 52.07,137.16 51.44,137.79 | IC1.5 91.02,120.14 C11.1 v92.71,121.28 | U27.5 110.17,109.95 C12.1 110.07,108.8 v109.22,107.95 v101.6,107.95 | C38.2 108.62,167.26 106.43,167.26 105.73,167.96 U25.5 105.7,168.28 102.87,168.28 101.6,167 92.08,167 91.12,167.96 U21.5 | ACC_POWER.1 110.49,167 109.64,167.85 C38.2 | U28.8 80.72,31.04 80.01,31.75 C48.1 78.95,32.8 v78.74,33.02 | v78.74,35.56 v109.22,35.56 | C47.1 76.62,59.56 IC3.5 75.25,60.01 v74.93,60.33 | v92.71,117.09 v101.6,117.09 | R52.2 4.45,142.24 5.71,143.51 C7.1 6.18,143.26 U26.P$7 8.63,143.26 v9.02,142.88 | R51.2 14.82,141.82 14.1,141.1 12.57,141.1 12.19,141.48 9.02,141.48 v8.89,141.6 | U16.19 78.37,144.51 77.69,145.2 C4.1 v79.38,146.69 | C40.1 36.06,60.54 IC2.5 36.52,62.42 v36.45,62.48
  Top 0.254: v36.45,67.31 v41.27,67.31 | U17.19 44.08,61.86 43.81,61.59 v41.27,61.59 41.91,60.96 C6.1 | v79.38,160.66 v86.36,160.66 | R107.2 R108.2 107.1,174.41 107.95,175.26 v109.86,175.26 | v109.22,169.54 C38.2 | v60.96,162.56 64.77,162.56 65.41,161.93 R109.2 65.41,162.56 66.67,163.83 77.47,163.83 v78.11,164.47 | v78.11,161.93 R38.2
  Top 0.61: IMU.VIN J6.1 50.67,11.56 52.7,9.53 U$2.23 U$1.52 U$1.51 | ACC_POWER.2 ACC_POWER.1 ACC_POWER.3 ACC_POWER.4 | J7.18 CELL.5V 8.89,125.09 15.24,118.75 v35.56,118.75 | v35.56,92.08 v43.81,92.08 v76.2,92.08 | BBB_RESET.P$1 J10.1 v75.56,63.5 | v57.15,127.25 v35.56,127.25 | SBUS-IN.P$2 SBUS-OUT.P$2 40.64,72.39 41.02,72.01 | 41.02,72.01 41.27,71.75 v41.27,71.37 | AUX_GPIO.1 41.02,72.01
  Top 1.016: v109.22,8.89 107.31,6.99 71.75,6.99 69.22,9.53 U$5.23 U$1.51 | IC4.3 109.09,142.24 C18.1 111.63,142.37 v111.76,142.24 112.39,141.6 112.39,137.79 111.76,137.16 v109.22,137.16
  Bottom 0.254: v26.67,149.86 26.67,156.84 27.94,158.12 v27.94,171.45 27.94,172.09 27.27,172.75 U3.5 26.98,174.53 C14.2 | v20.32,171.45 21.27,172.4 U7.5 21.27,174.53 C36.2 | v31.75,171.45 32.7,172.4 U10.5 32.7,174.53 C35.2 | v37.47,171.45 38.41,172.4 U5.5 38.41,174.53 C15.2 | C16.2 47.41,172.3 v48.26,171.45 | v8.89,149.86 8.89,143 v9.02,142.88 8.89,142.75 v8.89,141.6 8.89,140.34 v8.26,139.7 v8.26,137.16 v8.26,135.89 v8.26,133.35 v8.26,130.81 8.26,126.36 6.99,125.09 CELL.5V | v78.74,33.02 v78.74,35.56 | v74.93,60.33 74.93,62.87 v75.56,63.5 | v92.71,121.28 v92.71,117.09 | v101.6,117.09 v101.6,107.95 | v79.38,146.69 v79.38,160.66 v78.11,161.93 v78.11,164.47 | v36.45,62.48 v36.45,67.31 | v41.27,61.59 v41.27,67.31 v41.27,71.37 | v86.36,160.66 v86.36,167.64 | v109.86,175.26 109.86,170.18 v109.22,169.54 | v60.96,162.56 60.96,168.66 v60.58,169.04
  Bottom 0.61: ACC_POWER.4 111.76,160.02 v111.76,142.24 | v35.56,92.08 v35.56,118.75 v35.56,127.25 | v76.2,92.08 GPS.VIN J5.2 76.2,64.14 v75.56,63.5 | POWER_MON.9 v57.15,127.25 | AUX_GPIO.1 AUX_GPIO.2 v43.81,92.08
  Bottom 1.016: v109.22,8.89 v109.22,35.56 v109.22,107.95 v109.22,137.16
+7V4  (via drill 0.38, 1.02)
  Top 0.254: R55.2 106.94,113.41 108.27,112.08 U27.4 | R39.2 75.56,162.56 76.2,163.19 v87.63,163.19 | v87.63,158.12 96.01,158.12 96.14,157.99 98.17,157.99 98.3,158.12 101.73,158.12 101.85,157.99 103.89,157.99 104.01,158.12 v108.58,158.12 | v108.58,148.59 108.58,146.05
  Top 1.016: v106.05,144.78 107.31,146.05 108.58,146.05 ACC_POWER.15 ACC_POWER.16 | v106.05,111.12 105.41,111.12 104.14,112.39 R55.2 | J1.1 STEERING.P$1 89.53,93.98 90.81,92.71 v106.05,92.71
  Bottom 0.254: v87.63,163.19 v87.63,158.12 | v108.58,158.12 v108.58,148.59
  Bottom 1.016: v106.05,144.78 v106.05,111.12 v106.05,92.71
+7V4_OUT  (via drill 0.38)
  Top 0.254: R27.2 107.61,123.41 107.82,123.19 | U27.3 107.34,114.33 v107.31,114.3 | v107.31,117.47 107.31,119.38
  Top 1.016: L2.2 111.57,127.44 107.82,123.69 107.82,123.19 C26.1 C27.1 107.31,119.38 104.52,119.38 R55.1
  Bottom 0.254: v107.31,114.3 v107.31,117.47
+12V  (via drill 0.38, 0.61, 1.02)
  Top 0.254: R10.2 23.5,175.31 D3.C | R16.2 34.92,175.31 D5.C | R45.2 v40.64,176.53 | R37.2 29.21,175.31 D10.C | R31.2 17.78,175.31 D11.C | R4.2 v12.06,173.35 | R78.2 51.22,167.85 v52.07,167 | R84.2 100.33,171.83 v100.08,172.09 | R72.2 94.61,171.89 v94.36,172.14 | C30.1 91.02,125.18 C29.1 | R49.2 65.41,174.62
  Top 0.406: 40.64,176.59 v40.64,176.53
  Top 0.61: D16.C 52.02,172.14 50.8,173.35 50.8,175.9 v50.16,176.53 | D5.C 34.98,176.59 v34.92,176.53 | D10.C 29.27,176.59 v29.21,176.53 | D3.C 23.55,176.59 v23.5,176.53 | D11.C 17.84,176.59 v17.78,176.53 | D1.C 12.12,176.59 v12.06,176.53 | D8.C 40.7,176.59 v40.64,176.53
  Top 1.016: U1.5 U1.6 U1.7 U1.8 U6.5 U6.6 U6.7 U6.8 U2.5 U2.6 U2.7 U2.8 U8.5 U8.6 U8.7 U8.8 U4.5 U4.6 U4.7 U4.8 U11.5 U11.6 U11.7 U11.8 47.56,159.96 v47.62,160.02 47.62,158.12 49.59,156.15 U22.5 U22.6 U22.7 U22.8 | U24.8 U24.7 U24.6 U24.5 U20.8 U20.7 U20.6 U20.5 95.19,156.21 v93.34,156.21 v83.19,156.21 | D14.C v94.36,172.14 83.3,172.14 v83.24,172.09 83.24,170.81 82.61,170.18 75.56,170.18 74.3,171.45 T1.1 T1.2 T1.3 71.75,173.99 71.12,174.62 65.41,174.62 v62.23,174.62 | D18.C 100.39,172.14 v100.08,172.09 | U15.2 92.2,128.27 C28.1 | C28.1 91.57,130.94 v92.08,131.44 91.94,131.31 C43.1 79.5,131.31 77.98,132.84 15V-ENB.1 | C29.1 C28.1 | C17.1 89.03,142.24 v92.08,142.24 IC4.1 | C19.1 88.77,114.43 IC5.1
  Bottom 0.254: v12.06,173.35 v12.06,176.53 | v52.07,167 52.07,165.1 52.39,164.78
  Bottom 1.016: v47.62,160.02 52.39,164.78 57.15,169.54 | 57.15,169.54 v62.23,174.62 | 57.15,169.54 v50.16,176.53 v40.64,176.53 v34.92,176.53 v29.21,176.53 v23.5,176.53 v17.78,176.53 v12.06,176.53 | v83.19,156.21 83.24,156.26 v83.24,172.09 | v100.08,172.09 94.67,172.09 v94.36,172.14 | v93.34,156.21 92.71,155.57 92.71,142.88 v92.08,142.24 v92.08,131.44 90.81,130.18 90.81,114.94 90.17,114.3 IC5.1
+15V  (via drill 1.02)
  Top 0.254: C44.1 73.16,119.89 71.75,121.28 68.16,121.28 R60.2
  Top 1.016: C44.1 v75.56,119.38 D20.C | POE-DEVICE.4 97.16,20.32 99.69,22.86 v112.39,22.86 | v112.39,106.68 100.33,106.68 99.06,107.95 v75.56,107.95 | ACC_POWER.14 ACC_POWER.13
  Bottom 1.016: POE-DEVICE.5 97.16,18.41 POE-DEVICE.4 | v112.39,22.86 v112.39,106.68 112.39,139.06 108.58,142.88 108.58,146.69 ACC_POWER.13 | v75.56,107.95 v75.56,119.38
AUX_ADC_0  (via drill 0.38)
  Top 0.254: R113.4 27.07,127.4 29.34,129.67 57.28,129.67 v58.42,130.81
  Bottom 0.254: v58.42,130.81 58.42,137.79 POWER_MON.10
AUX_ADC_1  (via drill 0.38)
  Top 0.254: R113.6 27.29,126.6 29.84,129.16 58.67,129.16 v59.69,130.18
  Bottom 0.254: v59.69,130.18 POWER_MON.11
AUX_GPIO_0_3V3  (via drill 0.38)
  Top 0.254: U$1.21 U$4.14 v42.55,29.84 | U17.3 44.73,55.4 44.45,55.12 v41.91,55.12
  Bottom 0.254: v41.91,55.12 41.27,54.48 41.27,33.66 42.55,32.38 v42.55,29.84
AUX_GPIO_0_5V  (via drill 0.38)
  Top 0.254: U17.18 44.73,63.22 v44.07,63.88 | v44.07,69.6 v48.9,69.6
  Bottom 0.254: v44.07,63.88 v44.07,69.6 | v48.9,69.6 AUX_GPIO.5
AUX_GPIO_1_3V3  (via drill 0.38)
  Top 0.254: U$1.23 U$4.13 v41.27,32.38 | U17.1 42.92,56.77 v42.55,57.15
  Bottom 0.254: v42.55,57.15 40.64,55.24 40.64,33.02 v41.27,32.38
AUX_GPIO_1_5V  (via drill 0.38)
  Top 0.254: U17.20 42.8,62.61 v42.55,62.87 | v42.55,70.36 v47.62,70.36
  Bottom 0.254: v42.55,62.87 v42.55,70.36 | v47.62,70.36 47.62,73.28 AUX_GPIO.6
AUX_GPIO_2_3V3  (via drill 0.38)
  Top 0.254: U$1.25 U$4.12 v42.04,34.92 | v42.55,53.47 45.09,53.47 46.03,54.41 U17.5
  Bottom 0.254: v42.04,34.92 41.91,35.05 41.91,52.83 v42.55,53.47
AUX_GPIO_2_5V  (via drill 0.38)
  Top 0.254: U17.16 46.03,61.27 v45.72,60.96 | v45.97,68.07 v51.44,68.07
  Bottom 0.254: v45.72,60.96 45.72,63.12 45.97,63.37 v45.97,68.07 | v51.44,68.07 AUX_GPIO.7
BATMON  (via drill 0.38)
  Top 0.254: v59.69,158.12 59.44,157.86 50.04,157.86 v49.91,157.99 | v50.16,153.03 v42.16,153.03 | v41.27,133.99 v30.48,133.99 | U$1.86 U$2.6 v30.48,52.7 | R49.1 R50.2 62.45,166.16 61.59,167 D13.C 61.59,169.54 60.96,170.18 v59.69,170.18
  Bottom 0.254: v59.69,170.18 59.69,165.35 59.82,165.23 59.82,164.72 59.69,164.59 v59.69,158.12 | v49.91,157.99 49.91,153.29 v50.16,153.03 | v42.16,153.03 42.16,145.67 41.27,144.78 v41.27,133.99 | v30.48,133.99 30.1,133.6 30.1,53.09 v30.48,52.7
BBB_I2C_1_SCL
  Top 0.254: R19.1 IMU.SCL J6.4 52.07,22.23 53.34,23.5 63.5,23.5 U$1.63 U$5.17
BBB_I2C_1_SDA
  Top 0.254: R20.1 IMU.SDA J6.5 U$2.17 U$1.64
BBB_I2C_2_SCL  (via drill 0.38)
  Top 0.254: U26.P$4 11.54,144.26 | 11.54,144.26 12.06,144.78 R53.1 | v42.55,28.57 56.52,28.57 57.15,27.94 60.96,27.94 61.59,28.57 63.5,28.57 U$1.65 U$5.16 | 11.54,144.26 11.54,145.05 v11.43,145.16 | v42.55,26.67 35.94,26.67 35.81,26.54 35.31,26.54 35.18,26.67 v33.15,26.67 | v32.89,62.99 20.83,62.99 v20.32,63.5 | v20.32,87.63 v13.34,87.63
  Bottom 0.254: v11.43,145.16 11.43,145.03 14.1,142.37 14.1,88.39 v13.34,87.63 | v42.55,28.57 v42.55,26.67 | v33.15,26.67 32.89,26.92 32.89,61.59 33.15,61.85 33.15,62.74 v32.89,62.99 | v20.32,63.5 v20.32,87.63
BBB_I2C_2_SDA  (via drill 0.38)
  Top 0.254: R54.1 6.99,144.78 7.5,144.26 U26.P$5 9.39,144.26 v10.29,145.16 | U$1.66 U$2.16 53.34,27.3 52.07,26.04 43.05,26.04 42.93,25.91 42.29,25.91 42.16,26.04 33.53,26.04 33.4,25.91 32.51,25.91 v32.38,26.04 | v32.38,62.23 v20.95,62.23 | v20.95,88.9 v13.34,88.9
  Bottom 0.254: v10.29,145.16 13.59,141.86 13.59,89.15 v13.34,88.9 | v32.38,26.04 v32.38,62.23 | v20.95,62.23 20.95,63.12 21.08,63.25 21.08,63.75 20.95,63.88 20.95,87.38 21.08,87.5 21.08,87.76 20.95,87.88 v20.95,88.9
BBB_MISO  (via drill 0.38)
  Top 0.254: U$1.76 61.59,40.01 60.33,38.73 57.02,38.73 U$2.11 v50.8,40.01 | U17.6 46.68,53.79 v46.61,53.72 | v46.35,45.72 v50.8,45.72
  Bottom 0.254: v46.61,53.72 46.61,45.97 v46.35,45.72 | v50.8,45.72 v50.8,40.01
BBB_MISO_5V  (via drill 0.38)
  Top 0.254: U17.15 46.68,63.57 v46.99,63.88 | v46.99,67.31 v52.7,67.31
  Bottom 0.254: v46.99,63.88 v46.99,67.31 | v52.7,67.31 52.7,73.28 AUX_GPIO.10
BBB_MOSI  (via drill 0.38)
  Top 0.254: U$1.75 U$5.11 | v60.33,53.98 48.26,53.98 47.33,54.91 U17.7
  Bottom 0.254: U$1.75 63.5,41.27 63.5,43.18 62.87,43.81 61.21,43.81 59.69,45.34 59.69,53.34 v60.33,53.98
BBB_MOSI_5V  (via drill 0.38)
  Top 0.254: U17.14 47.33,61.26 v48.26,60.33 | v48.26,66.55 v53.98,66.55
  Bottom 0.254: v48.26,60.33 v48.26,66.55 | v53.98,66.55 AUX_GPIO.9
BBB_RESET_3V3  (via drill 0.38)
  Top 0.254: R48.2 U$1.56 63.5,15.88 73.03,15.88 74.93,13.97 v104.14,13.97 | U16.8 69.5,140.62 v68.71,139.83 | v69.22,102.87 91.44,102.87 v91.95,102.36 | v92.08,26.04 93.34,27.3 v104.14,27.3
  Bottom 0.254: U$2.21 U$1.56 | v68.71,139.83 68.45,139.57 68.45,103.63 v69.22,102.87 | v91.95,102.36 92.71,101.6 92.71,31.75 92.08,31.11 v92.08,26.04 | v104.14,27.3 v104.14,13.97
BBB_RESET_5V  (via drill 0.38)
  Top 0.254: IC3.4 76.52,61.91 v77.47,60.96 | U16.13 81,140.62 v81.53,140.08
  Bottom 0.254: v77.47,60.96 80.64,64.14 80.64,108.46 81.53,109.35 v81.53,140.08
BBB_SCLK  (via drill 0.38)
  Top 0.254: U$5.10 U$1.77 | v63.5,51.44 v45.09,51.44 | U17.4 45.38,54.91 v45.09,54.61
  Bottom 0.254: U$1.77 63.5,43.81 v63.5,51.44 | v45.09,54.61 v45.09,51.44
BBB_SCLK_5V  (via drill 0.38)
  Top 0.254: U17.17 45.38,63.71 v45.21,63.88 | v45.21,68.83 v50.16,68.83
  Bottom 0.254: v45.21,63.88 v45.21,68.83 | v50.16,68.83 50.16,73.28 AUX_GPIO.8
BBB_STAT_LIGHT_3V3
  Top 0.254: U$1.68 61.59,29.84 60.33,28.57 57.78,28.57 56.52,29.84 U$2.15
BBB_STATUS_LIGHTS_5V  (via drill 0.38)
  Top 0.254: U16.14 82.89,141.26 v83.31,140.84 | D27.C v84.45,83.19 84.45,82.13 R95.2
  Bottom 0.254: v83.31,140.84 83.31,108.08 82.68,107.44 82.68,84.96 v84.45,83.19
BBB_UART0_RX  (via drill 0.38)
  Top 0.254: BBB_CONSOLE.RXI 60.33,40.01 61.59,41.27 v71.88,41.27 | v71.88,45.72 R93.2 78.53,46.62 D26.C
  Bottom 0.254: v71.88,41.27 v71.88,45.72
BBB_UART0_TX  (via drill 0.38)
  Top 0.254: BBB_CONSOLE.TXO 60.33,37.47 61.59,38.73 v73.03,38.73 | v73.03,43.18 R94.2 78.53,42.27 D25.C
  Bottom 0.254: v73.03,38.73 v73.03,43.18
BBB_UART1_RX_3V3  (via drill 0.38)
  Top 0.254: U$1.70 61.59,32.38 60.33,31.11 57.28,31.11 U$2.14 | v52.07,55.24 48.26,55.24 47.98,55.52 U17.8
  Bottom 0.254: U$2.14 52.7,35.56 52.7,54.61 v52.07,55.24
BBB_UART1_RX_5V  (via drill 0.38)
  Top 0.254: U28.1 v78.74,29.84 | v80.01,39.37 v76.83,39.37 | v73.66,61.59 48.26,61.59 47.98,61.88 U17.13
  Bottom 0.254: v78.74,29.84 80.01,31.11 v80.01,39.37 | v76.83,39.37 76.83,44.45 73.66,47.62 v73.66,61.59
BBB_UART1_TX_3V3  (via drill 0.38)
  Top 0.254: U$1.72 61.59,34.92 60.33,33.66 57.02,33.66 U$2.13 | U17.9 48.63,56.15 48.9,55.88 50.8,55.88 51.44,56.52 v53.98,56.52
  Bottom 0.254: v53.98,56.52 53.98,36.7 U$2.13
BBB_UART1_TX_5V  (via drill 0.38)
  Top 0.254: U28.4 75.49,24.84 v75.56,24.77 | v72.39,69.85 v55.88,69.85 | v55.88,65.79 v51.05,65.79 | U17.12 48.63,63.87 48.9,64.14 50.42,64.14 v51.05,63.5
  Bottom 0.254: v75.56,24.77 75.56,36.83 74.3,38.1 74.3,45.72 72.39,47.62 v72.39,69.85 | v55.88,69.85 v55.88,65.79 | v51.05,65.79 v51.05,63.5
CELL_CTS  (via drill 0.38)
  Top 0.254: J7.9 CELL.CTS | v1.52,43.81 15.24,43.81 U$1.31 U$4.9
  Bottom 0.254: CELL.CTS 5.84,102.23 4.57,100.97 4.57,76.96 2.67,75.06 2.67,51.44 3.05,51.05 3.05,46.74 1.52,45.21 v1.52,43.81
CELL_KEY  (via drill 0.38)
  Top 0.254: J7.8 CELL.KEY | U$1.40 U$3.5 v3.38,52.7
  Bottom 0.254: CELL.KEY 6.35,99.69 5.08,98.42 5.08,76.71 3.17,74.8 3.17,52.96 v3.38,52.7
CELL_NET_STATUS  (via drill 0.38)
  Top 0.254: J7.5 CELL.NS | U$1.34 U$3.8 v3.17,45.09
  Bottom 0.254: CELL.NS 7.62,92.08 8.26,91.44 8.26,78.49 4.19,74.42 4.19,53.59 4.57,53.21 4.57,51.56 4.06,51.05 4.06,46.23 3.17,45.34 v3.17,45.09
CELL_POWER_STATUS  (via drill 0.38)
  Top 0.254: J7.6 CELL.PS | v1.27,37.47 U$3.11 U$1.28
  Bottom 0.254: CELL.PS 8.26,94.61 8.76,94.11 8.76,78.23 4.7,74.17 4.7,53.72 5.08,53.34 5.08,51.44 4.57,50.93 4.57,40.77 v1.27,37.47
CELL_RESET  (via drill 0.38)
  Top 0.254: J7.14 CELL.RST | v1.27,47.62 U$3.7 U$1.36
  Bottom 0.254: CELL.RST 5.71,114.94 2.54,111.76 2.54,78.11 0.64,76.2 0.64,48.26 v1.27,47.62
CELL_RING  (via drill 0.38)
  Top 0.254: J7.7 CELL.RI | v1.27,40.01 U$3.10 U$1.30
  Bottom 0.254: CELL.RI 6.35,97.16 5.59,96.39 5.59,76.58 3.68,74.68 3.68,53.47 4.06,53.09 4.06,51.82 3.56,51.31 3.56,46.48 2.41,45.34 2.41,41.15 v1.27,40.01
CELL_RTS  (via drill 0.38)
  Top 0.254: J7.11 CELL.RTS | v1.27,42.55 U$3.9 U$1.32
  Bottom 0.254: CELL.RTS 5.84,107.31 4.06,105.54 4.06,77.34 2.16,75.44 2.16,51.18 2.54,50.8 2.54,46.99 0.64,45.09 0.64,43.18 v1.27,42.55
CELL_RX  (via drill 0.38)
  Top 0.254: J7.13 CELL.RX | v1.4,48.9 15.24,48.9 U$1.37 U$4.6
  Bottom 0.254: CELL.RX 5.59,112.39 3.05,109.86 3.05,77.85 1.14,75.95 1.14,49.15 v1.4,48.9
CELL_TX  (via drill 0.38)
  Top 0.254: J7.12 CELL.TX | v1.83,50.16 U$3.6 U$1.38 15.24,51.44 v29.21,51.44 | v29.21,57.15 v31.5,57.15 | v31.5,64.14 35.56,64.14 SJ1.3
  Bottom 0.254: CELL.TX 5.71,109.86 3.56,107.7 3.56,77.6 1.65,75.69 1.65,50.37 v1.83,50.16 | v29.21,51.44 v29.21,57.15 | v31.5,57.15 v31.5,64.14
CHARGE_CURRENT  (via drill 0.38)
  Top 0.254: R113.2 26.6,128.2 28.57,130.18 53.98,130.18 v54.61,130.81
  Bottom 0.254: v54.61,130.81 POWER_MON.7
CHARGE_VOLTAGE  (via drill 0.38)
  Top 0.254: v50.8,132.08 49.53,130.81 27.94,130.81 26.74,129.61 R112.8
  Bottom 0.254: v50.8,132.08 50.8,137.79 POWER_MON.6
DISARM_RELAY_IN_3V3  (via drill 0.38)
  Top 0.254: U$3.14 U$1.22 15.24,31.11 v34.29,31.11 | v32.13,126.11 36.32,126.11 36.7,126.49 56.52,126.49 56.64,126.36 v62.74,126.36 | U16.6 63.94,141.91 v62.99,140.97
  Bottom 0.254: v34.29,31.11 34.29,33.15 34.42,33.27 34.42,34.29 34.16,34.54 34.16,83.19 31.62,85.72 31.62,125.6 v32.13,126.11 | v62.74,126.36 62.74,128.4 62.99,128.65 62.99,129.29 62.74,129.54 62.74,140.72 v62.99,140.97
DISARM_RELAY_IN_5V  (via drill 0.38)
  Top 0.254: v84.45,141.6 83.82,141.6 83.51,141.91 U16.15 | R90.2 93.34,173.99 92.71,173.35 89.48,173.35 D22.C 88.08,173.94 87.12,172.97 85.47,172.97 v85.09,173.35
  Bottom 0.254: v85.09,173.35 85.09,144.78 85.22,144.65 85.22,143.89 85.09,143.76 85.09,142.24 v84.45,141.6
ENABLE_RELAY_IN_3V3  (via drill 0.38)
  Top 0.254: U$3.15 U$1.20 15.24,28.57 v34.92,28.57 | v32.38,127.25 33.27,128.14 61.47,128.14 v62.23,128.91 | U16.5 63.19,142.56 v62.87,142.24
  Bottom 0.254: v34.92,28.57 34.92,30.73 35.05,30.86 35.05,31.37 34.92,31.5 34.92,34.8 34.67,35.05 34.67,83.82 32.13,86.36 32.13,123.57 33.66,125.09 33.66,125.98 v32.38,127.25 | v62.23,128.91 62.23,141.6 v62.87,142.24
ENABLE_RELAY_IN_5V  (via drill 0.38)
  Top 0.254: U16.16 83.51,142.56 v83.82,142.88 | IC1.2 v87.63,118.75 R98.1 | v87,144.27 v84.45,144.27 | D23.C 86.36,174.62 | 86.36,174.62 87,175.26 89.95,175.26 R89.2 | 86.36,174.62 v84.45,174.62
  Bottom 0.254: v84.45,174.62 84.45,173.74 84.33,173.61 84.33,173.1 84.45,172.97 v84.45,144.27 84.45,143.51 v83.82,142.88 | v87.63,118.75 87.63,121.67 87.5,121.79 87.5,122.43 87.76,122.68 87.63,143.64 v87,144.27
GND  (via drill 0.38)
  Top 0.254: U$3.24 U$1.2
  Top 0.406: U29.11 71.11,125.08 U29.P$1
  other vias: 45.72,173.48 46.1,169.42 45.47,175.39 39.75,175.39 33.91,175.39 28.32,175.26 22.61,175.39 16.76,175.39 28.7,166.75 34.42,166.75 40.13,166.75 45.97,166.62 22.99,166.75 17.27,166.75 33.91,151.38 59.05,164.97 57.15,162.69 73.03,128.91 72.39,128.91 71.75,128.91 71.12,128.91 70.48,128.91 73.03,122.56 72.39,122.56 71.75,122.56 71.12,122.56 70.48,122.56 70.48,123.83 71.12,123.83 71.75,123.83 72.39,123.83 73.03,124.46 70.48,124.46 70.48,127.64 71.12,127.64 71.75,127.64 72.39,127.64 73.03,127.64 73.03,127 70.48,127 70.48,126.36 70.48,125.73 70.48,125.09 73.03,125.09 73.03,125.73 73.03,126.36 9.78,142.24 9.65,173.99 6.86,173.35 88.27,122.17 94.74,120.4 92.08,122.17
  pour Top: 0,0 114.3,0 114.3,195.58 0,195.58
  pour Bottom: 0,0 114.3,0 114.3,195.58 0,195.58
GNSS_ENABLE  (via drill 0.38)
  Top 0.254: U$2.20 v57.78,17.14 U$1.58
  Bottom 0.254: GPS.EN J5.8 60.96,78.74 57.78,75.56 57.78,70.48 57.15,69.85 57.15,64.14 57.78,63.5 57.78,59.56 57.66,59.44 57.66,58.67 57.78,58.55 v57.78,17.14
GNSS_FIX  (via drill 0.38)
  Top 0.254: v66.04,75.56 v59.05,75.56 | v60.33,20.95 63.5,20.95 U$1.61 U$5.18
  Bottom 0.254: GPS.FIX J5.6 v66.04,75.56 | v59.05,75.56 59.05,70.48 57.78,69.22 57.78,64.77 59.05,63.5 59.05,59.56 59.18,59.44 59.18,58.67 59.05,58.55 59.05,45.09 60.33,43.81 v60.33,20.95
GNSS_RX  (via drill 0.38)
  Top 0.254: v71.12,19.68 U$5.19 U$1.59
  Bottom 0.254: GPS.RX J5.4 v71.12,19.68
GNSS_TX  (via drill 0.38)
  Top 0.254: U$1.57 U$5.20 v70.48,17.14 | SJ1.1 51.44,64.77 52.07,64.14 57.15,64.14 58.42,62.87 62.87,62.87 64.14,64.14 v69.85,64.14
  Bottom 0.254: GPS.TX J5.5 68.58,66.17 69.91,64.83 | v70.48,17.14 70.48,19.18 70.36,19.3 70.36,20.19 70.61,20.45 70.61,64.14 69.91,64.83 | v69.85,64.14 69.85,64.77 69.91,64.83
I2C_SCL_5V  (via drill 0.38)
  Top 0.254: U26.P$1 11.54,142.76 v12.06,142.24 R51.1 | v5.33,138.56 5.55,138.77 U18.3 10.5,138.77 v10.79,139.06 | v5.21,131.7 5.29,131.78 U19.3 9.82,131.78 v10.16,131.44 | v21.59,91.44 v10.16,91.44 | v22.48,83.31 46.23,83.31 v46.35,83.19
  Bottom 0.254: v5.33,138.56 5.33,131.83 v5.21,131.7 | v10.79,139.06 10.79,140.97 v12.06,142.24 | v22.48,83.31 22.48,90.55 v21.59,91.44 | v10.16,91.44 v10.16,131.44 | v46.35,83.19 AUX_GPIO.4
I2C_SDA_5V  (via drill 0.38)
  Top 0.254: U26.P$8 7.5,142.76 6.99,142.24 R52.1 5.93,141.19 v4.45,139.7 4.72,139.42 U18.2 | v4.45,132.72 4.72,132.44 U19.2 10.52,132.44 v10.79,132.72 | v21.08,89.92 11.05,89.92 v10.79,90.17 | v21.84,82.3 44.7,82.3 v45.09,81.92
  Bottom 0.254: v4.45,139.7 v4.45,132.72 | v10.79,132.72 10.79,131.95 10.92,131.83 10.92,131.06 10.79,130.94 10.79,91.95 10.92,91.82 10.92,91.19 10.79,91.06 v10.79,90.17 | v21.84,82.3 21.59,82.55 21.59,88.52 21.72,88.65 21.72,89.28 v21.08,89.92 | v45.09,81.92 45.09,73.28 AUX_GPIO.3
MOT_CURRENT  (via drill 0.38)
  Top 0.254: 49.5,132.44 v49.53,132.46 49.28,132.72 43.18,132.72 42.55,132.08 26.67,132.08 25.8,131.21 R112.4
  Bottom 0.254: v49.53,132.46 POWER_MON.3
MOT_VOLTAGE  (via drill 0.38)
  Top 0.254: 48.3,131.78 v48.26,131.83 43.56,131.83 43.18,131.44 27.3,131.44 26.27,130.41 R112.6
  Bottom 0.254: v48.26,131.83 48.26,137.67 POWER_MON.2
N$1  (via drill 0.38)
  Top 0.254: U1.3 v13.97,162.56 | R1.2 13.97,157.69 v13.97,158.12 12.91,157.06 R2.1
  Bottom 0.254: v13.97,162.56 v13.97,158.12
N$2  (via drill 0.38)
  Top 0.254: U1.2 v15.24,162.56 | v15.24,158.12 16.3,157.06 R3.2
  Bottom 0.254: v15.24,162.56 v15.24,158.12
N$3
  Top 0.254: R5.1 14.02,168.65 R4.1 11.62,170.15 U9.3
  Top 1.016: U1.4 12.7,166.75 R5.1
N$4  (via drill 0.38)
  Top 0.254: U2.3 v25.4,162.56 | v25.4,158.12 25.4,157.69 R7.2 R8.1
  Bottom 0.254: v25.4,162.56 v25.4,158.12
N$5  (via drill 0.38)
  Top 0.254: U2.2 v26.67,162.56 | v26.67,158.12 27.73,157.06 R9.2
  Bottom 0.254: v26.67,162.56 v26.67,158.12
N$6  (via drill 0.38)
  Top 0.254: R11.1 25.45,168.65 R10.1 v23.5,169.54
  Top 1.016: U2.4 24.13,166.75 R11.1
  Bottom 0.254: U3.3 24.1,170.15 v23.5,169.54
N$7  (via drill 0.38)
  Top 0.254: U4.3 v36.83,162.56 | v36.83,158.12 36.83,157.69 R13.2 R14.1
  Bottom 0.254: v36.83,162.56 v36.83,158.12
N$8  (via drill 0.38)
  Top 0.254: U4.2 v38.1,162.56 | v38.1,158.12 39.16,157.06 R15.2
  Bottom 0.254: v38.1,162.56 v38.1,158.12
N$9  (via drill 0.38)
  Top 0.254: R17.1 36.88,168.65 R16.1 v34.92,169.54
  Top 1.016: U4.4 35.56,166.75 R17.1
  Bottom 0.254: U5.3 35.53,170.15 v34.92,169.54
N$10  (via drill 0.38)
  Top 0.254: U6.3 v19.68,162.56 | R25.2 19.68,157.69 v19.68,158.12 18.63,157.06 R29.1
  Bottom 0.254: v19.68,162.56 v19.68,158.12
N$11  (via drill 0.38)
  Top 0.254: U6.2 v20.95,162.56 | v20.95,158.12 22.01,157.06 R30.2
  Bottom 0.254: v20.95,162.56 v20.95,158.12
N$12  (via drill 0.38)
  Top 0.254: R32.1 19.73,168.65 R31.1 v17.78,169.54
  Top 1.016: U6.4 18.41,166.75 R32.1
  Bottom 0.254: U7.3 18.39,170.15 v17.78,169.54
N$13  (via drill 0.38)
  Top 0.254: U8.3 v31.11,162.56 | v31.11,158.12 31.11,157.69 R34.2 R35.1
  Bottom 0.254: v31.11,162.56 v31.11,158.12
N$14  (via drill 0.38)
  Top 0.254: U8.2 v32.38,162.56 | v32.38,158.12 33.44,157.06 R36.2
  Bottom 0.254: v32.38,162.56 v32.38,158.12
N$15  (via drill 0.38)
  Top 0.254: R40.1 31.16,168.65 R37.1 v29.21,169.54
  Top 1.016: U8.4 29.84,166.75 R40.1
  Bottom 0.254: U10.3 29.82,170.15 v29.21,169.54
N$16  (via drill 0.38)
  Top 0.254: U11.3 v42.55,162.56 | v42.55,158.12 42.55,157.69 R42.2 R43.1
  Bottom 0.254: v42.55,162.56 v42.55,158.12
N$17  (via drill 0.38)
  Top 0.254: U11.2 v43.81,162.56 | v43.81,158.12 44.87,157.06 R44.2
  Bottom 0.254: v43.81,162.56 v43.81,158.12
N$18
  Top 0.254: R45.1 42.59,168.65 R46.1 48.63,168.65 49.21,169.22 U12.3
  Top 1.016: U11.4 41.27,166.75 R46.1
N$19
  Bottom 0.254: J5.1 GPS.PPS
N$20
  Bottom 0.254: J5.7 GPS.VBAT
N$21
  Top 0.254: U$5.15 U$1.67
N$22
  Top 0.254: U$1.74 61.59,37.47 60.33,36.2 57.28,36.2 U$2.12
N$23  (via drill 0.38)
  Top 0.254: IC3.2 R96.2 80.43,59.48 v80.01,59.05 | v80.01,54.61 80.01,55.19 D28.C
  Bottom 0.254: v80.01,59.05 v80.01,54.61
N$24  (via drill 0.38)
  Top 0.254: U20.3 v96.52,158.75 | v96.52,154.31 96.52,153.88 R69.2 R70.1
  Bottom 0.254: v96.52,158.75 v96.52,154.31
N$25  (via drill 0.38)
  Top 0.254: U20.2 v97.79,158.75 | v97.79,154.31 98.84,153.25 R71.2
  Bottom 0.254: v97.79,158.75 v97.79,154.31
N$26
  Top 0.254: 95.89,163.83 95.25,163.83 94.61,164.47 R72.1 94.17,165.71 U21.3
  Top 0.61: U20.4 95.25,163.19 95.89,163.83 96.78,163.83 R73.1
N$27
  Top 0.254: U28.7 82.68,28.57 J11.1 RS485.P$1
N$28
  Top 0.254: IMU.3VO J6.2
N$29
  Top 0.254: J6.6 IMU.GINT
N$30
  Top 0.254: IMU.GRDY J6.7
N$31
  Top 0.254: J6.8 IMU.LIN1
N$32
  Top 0.254: IMU.LIN2 J6.9
N$33
  Top 0.254: IMU.LRDY J6.10
N$34  (via drill 0.38)
  Top 0.254: U22.3 v52.7,158.75 | v52.7,154.31 52.7,153.88 R75.2 R76.1
  Bottom 0.254: v52.7,158.75 v52.7,154.31
N$35
  Bottom 0.254: J5.9 GPS.3V3
N$36
  Top 0.254: IC1.4 93.03,117.8 93.34,118.11 93.34,120.78 93.47,120.9 93.47,121.67 93.34,121.79 93.34,124.46 92.71,125.09 92.71,126.36 93.34,127 U15.3
N$37
  Top 0.254: J7.2 CELL.SPKR+
N$38
  Top 0.254: J7.3 CELL.MIC-
N$39
  Top 0.254: J7.4 CELL.MIC+
N$40
  Top 0.254: J7.10 CELL.DTR
N$41
  Top 0.254: J7.17 CELL.BAT
N$42
  Top 0.254: J7.1 CELL.SPKR-
N$43
  Top 0.254: POE-LAN.1 74.93,15.88 75.56,15.24 92.71,15.24 93.34,15.88 POE-DEVICE.1
N$44
  Top 0.254: POE-LAN.2 76.2,20.95 76.83,21.59 93.98,21.59 94.61,20.95 POE-DEVICE.2
N$45
  Bottom 0.254: POE-LAN.3 77.47,15.88 78.11,15.24 95.25,15.24 95.89,15.88 POE-DEVICE.3
N$46
  Top 0.254: U$1.27 U$4.11
N$47
  Top 0.254: U$1.29 U$4.10
N$48  (via drill 0.38)
  Top 0.254: U22.2 v53.98,158.75 | v53.98,154.31 55.03,153.25 R77.2
  Bottom 0.254: v53.98,158.75 v53.98,154.31
N$49
  Top 0.254: 52.45,164.21 51.7,164.21 50.8,165.1 R78.1 | U23.3 58.1,166.69 57.91,166.88 53.85,166.88 53.34,166.37 R79.1
  Top 1.016: U22.4 51.44,163.19 52.45,164.21 R79.1
N$50  (via drill 0.38)
  Top 0.254: U24.3 v102.23,158.75 | v102.23,154.31 102.23,153.88 R81.2 R82.1
  Bottom 0.254: v102.23,158.75 v102.23,154.31
N$51  (via drill 0.38)
  Top 0.254: U24.2 v103.5,158.75 | v103.5,154.31 104.56,153.25 R83.2
  Bottom 0.254: v103.5,158.75 v103.5,154.31
N$52
  Top 0.254: R84.1 100.33,165.1 101.22,164.21 R85.1 102.87,165.35 104.27,166.75 107.44,166.75 107.63,166.56 U25.3
  Top 0.61: U24.4 100.97,163.19 101.97,164.21 R85.1
N$53  (via drill 0.38)
  Top 0.254: v37.47,59.69 IC2.2 | D21.C 31.11,65.41 31.96,66.25 R91.2 34.92,67.31 36.2,68.58 v37.47,68.58
  Bottom 0.254: v37.47,68.58 v37.47,59.69
N$54
  Top 0.254: POE-LAN.6 81.92,19.68 83.19,18.41 98.42,18.41 POE-DEVICE.6
N$55
  Top 0.254: SJ1.2 37.47,61.94 IC2.4 38.87,60.54 R57.1
N$56
  Top 0.254: U$1.33 U$4.8
N$57
  Top 0.254: U$1.35 U$4.7
N$58
  Top 0.254: U$1.39 U$4.5
N$59
  Top 0.254: RLY0.A R62.1
N$60
  Top 0.254: RLY1.A R63.1
N$61
  Top 0.254: RLY2.A R64.1
N$62  (via drill 1.02)
  Top 0.61: J2.1 STATUS_LIGHTS.P$1
  Top 1.016: v96.52,76.2 93.34,76.2 90.81,78.74 STATUS_LIGHTS.P$1
  Bottom 1.016: F2.P$1 v96.52,76.2
N$64
  Top 0.254: R68.1 DISARM.A
N$65
  Top 0.254: RLY3.A R65.1
N$66
  Top 0.254: RLY4.A R66.1
N$67
  Top 0.254: RLY5.A R67.1